# Altium schematic sheet EM4095.SchDoc
size A
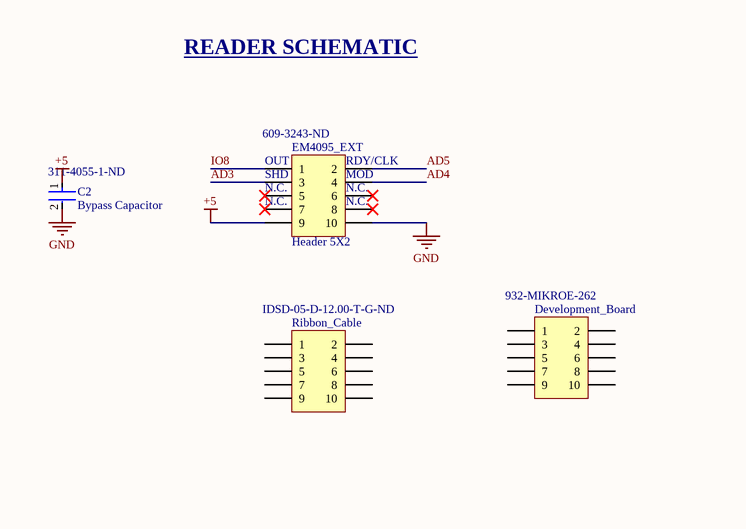
[diagram p0: EM4095.SchDoc, left]

## Parts
C2  Bypass Capacitor  Supplier Part Number 1: 311-4055-1-ND  [FP-CC0603-DA-MFG]
Development_Board  Supplier Part Number 1: 932-MIKROE-262  [HDR2X5]  (mechanical)
EM4095_EXT  Header 5X2  Supplier Part Number 1: 609-3243-ND  [HDR2X5]
Ribbon_Cable  Supplier Part Number 1: IDSD-05-D-12.00-T-G-ND  [HDR2X5]  (mechanical)

## Nets
+5: C2.1 EM4095_EXT.9
GND: C2.2 EM4095_EXT.10
AD3: EM4095_EXT.3
AD4: EM4095_EXT.4
AD5: EM4095_EXT.2
IO8: EM4095_EXT.1

Not connected (* = marked no-connect by the designer): Development_Board 1 2 3 4 5 6 7 8 9 10; EM4095_EXT 5* 6* 7* 8*; Ribbon_Cable 1 2 3 4 5 6 7 8 9 10

## Notes on the sheet
- READER SCHEMATIC
- (near EM4095_EXT) OUT
- (near EM4095_EXT) SHD
- (near EM4095_EXT) RDY/CLK
- (near EM4095_EXT) MOD
- (near EM4095_EXT) N.C.

## Library data of the parts
C2 = CMP-03422-001228-1: CAP CER 0.1UF 10V X7R 0603; Manufacturer Part Number: CC0603KRX7R6BB104; Manufacturer: YAGEO; Material: Ceramic; Tolerance: 0.1; Capacitance: 100 nF; Temperature Coefficient: 15%; Value: 100 nF; Multilayer: Yes; Tolerance  (fill in as +-): 10%; Height: 0.9mm; RoHS: TRUE; Footprint Url: http://www.yageo.com/exep/pages/download/literatures/UPY-C_GEN_24.pdf; Octopart: https://octopart.com/cc0603krx7r6bb104-yageo-9291607; Device Class L1: Passive Components; Mouser Description: 0603 0.1 uF 10 V ±10 % Tolerance X7R SMT Multilayer Ceramic Capacitor; ComponentLink2URL: http://www.yageo.com/documents/recent/UPY-GPHC_X7R_6.3V-to-50V_18.pdf; Automotive: No; Voltage: 10 V; Device Class L3: Ceramic Capacitors; Category: Cap; Temperature: -55°C to +125°C; ComponentLink2Description: Datasheet; Voltage Rating: 10 V; Device Class L2: Capacitors; Lead Free: Yes; Temperature Range High: +125°C; Temperature Range Low: -55°C; Digikey Description: CAP CER 0.1UF 10V X7R 0603; Package: CC0603-DA; Temperature Characteristic: X7R; Supplier 1: Digikey; Stock 1: 58484; Pricing 1: 1=0.1, 10=0.055, 100=0.0327, 1000=0.02132 (USD); Mounting Technology: Surface Mount; Pins: 2; Dielectric Material: Ceramic; Package Shape: Rectangular; Case/Package: 0603; Terminal Finish: Nickel; Min Operating Temperature: -55°C; Max Operating Temperature: 125°C; JESD-609 Code: e3; Capacitor Type: Ceramic; Package Style: SMTMeter; Packaging: Tape and Reel; Tolerance (fill in as +-): 10%; Rated DC Voltage (URdc): 10V; Temperature Characteristics Code: X7R; Termination: Wraparound; Length: 1.6mm; Width: 0.8mm; Reach SVHC Compliant: Yes; RoHS Compliant: Yes; ComponentLink1URL: https://datasheet.ciiva.com:443/pdfs/VipMasterIC/IC/YAGO/YAGO-S-A0003557223/YAGO-S-A0003557223-1.pdf?src-supplier=IHS+Markit; ComponentLink1Description: https://datasheet.ciiva.com:443/pdfs/VipMasterIC/IC/YAGO/YAGO-S-A0003557223/YAGO-S-A0003557223-1.pdf?src-supplier=IHS+Markit; ComponentLink3URL: https://datasheet.ciiva.com/11586/upy-gphc-x7r-6-3v-to-50v-8-11586327.pdf?src-supplier=Avnet; ComponentLink3Description: https://datasheet.ciiva.com/11586/upy-gphc-x7r-6-3v-to-50v-8-11586327.pdf?src-supplier=Avnet
Development_Board = Header 5X2: EM4095 NFC/RFID Reader and Writer Development Board; Manufacturer: mikroElektronika; Manufacturer Part Number: MIKROE-262; Supplier 1: Mouser; RoHS: Yes; Category: Embedded Processors and Controllers; Stock 1: 16; Pricing 1: 1=29, 10=29, 50=29, 100=29, 1000=29, 10000=29 (USD); ComponentLink1URL: https://datasheet.ciiva.com/4712/rfid-manual-v100-31329-4712706.pdf?src-supplier=Mouser; ComponentLink1Description: https://datasheet.ciiva.com/4712/rfid-manual-v100-31329-4712706.pdf?src-supplier=Mouser; ComponentLink2URL: https://datasheet.ciiva.com/29616/rfid-manual-v100-29616555.pdf?src-supplier=Digikey; ComponentLink2Description: https://datasheet.ciiva.com/29616/rfid-manual-v100-29616555.pdf?src-supplier=Digikey
EM4095_EXT = Header 5X2: Board Connector, 66 Contact(s), 2 Row(s), Male, Straight, Solder Terminal; Manufacturer: Amphenol Communications Solutions; Manufacturer Part Number: 67997410HLF; LatestRevisionDate: 17-Jul-2002; LatestRevisionNote: Re-released for DXP Platform.; Publisher: Altium Limited; Supplier 1: Digikey; RoHS: No; Stock 1: 5769; Pricing 1: 1=0.3, 10=0.255, 400=0.19665, 800=0.18725, 1200=0.18197, 5200=0.16407, 10000=0.15667 (USD); ComponentLink1URL: https://datasheet.octopart.com/67997-410HLF-Amphenol-Communications-Solutions-datasheet-10288749.pdf?src-supplier=Farnell; ComponentLink1Description: https://datasheet.octopart.com/67997-410HLF-Amphenol-Communications-Solutions-datasheet-10288749.pdf?src-supplier=Farnell; ComponentLink2URL: https://datasheet.octopart.com/67997-410HLF-Areva-datasheet-15888151.pdf?src-supplier=Element14; ComponentLink2Description: https://datasheet.octopart.com/67997-410HLF-Areva-datasheet-15888151.pdf?src-supplier=Element14; ComponentLink3URL: https://datasheet.octopart.com/67997-410HLF-Amphenol-Communications-Solutions-datasheet-36854132.pdf?src-supplier=Electro+Sonic; ComponentLink3Description: https://datasheet.octopart.com/67997-410HLF-Amphenol-Communications-Solutions-datasheet-36854132.pdf?src-supplier=Electro+Sonic
Ribbon_Cable = Header 5X2: Cable Assembly, 28AWG; Manufacturer: Samtec; Manufacturer Part Number: IDSD-05-D-12.00-T-G; Supplier 1: Digikey; RoHS: Yes; Category: Cables and Wire; Stock 1: 125; Pricing 1: 1=6.19, 25=5.59, 50=5.2, 100=4.95, 500=4.05, 1000=3.75, 2500=3.6 (USD); Connector Support Type: CABLE ASSEMBLY; Reach SVHC Compliant: Yes; RoHS Compliant: Yes; ComponentLink1URL: https://datasheet.ciiva.com:443/pdfs/VipMasterIC/IC/SAMI/SAMI-S-A0008033238/SAMI-S-A0008033238-1.pdf?src-supplier=IHS+Markit; ComponentLink1Description: https://datasheet.ciiva.com:443/pdfs/VipMasterIC/IC/SAMI/SAMI-S-A0008033238/SAMI-S-A0008033238-1.pdf?src-supplier=IHS+Markit; ComponentLink2URL: ftp://ftp.samtec.com/webfiles/PDF/IDSS.PDF?src-supplier=Avnet; ComponentLink2Description: ftp://ftp.samtec.com/webfiles/PDF/IDSS.PDF?src-supplier=Avnet